# EAGLE design shem_v1.2 (EAGLE 5.08)
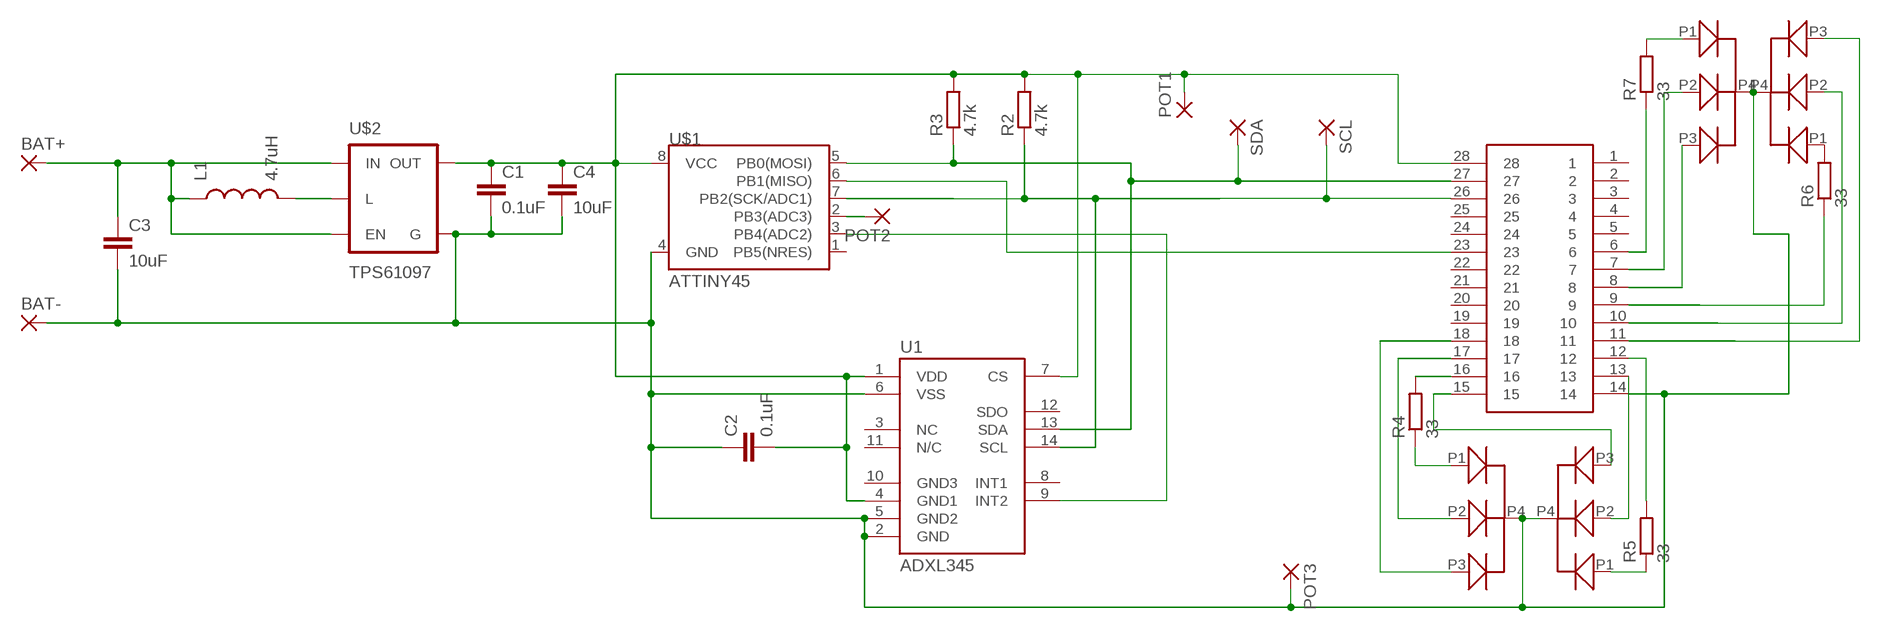
[diagram p0: schematic, sheet 1]

## Parts
BAT+  SMD5  [SMD2,54-5,08]
BAT-  SMD5  [SMD2,54-5,08]
C1  0.1uF  C-EUC1206  [C1206]
C2  0.1uF  C-EUC1206  [C1206]
C3  10uF  C-EUC1206  [C1206]
C4  10uF  C-EUC1206  [C1206]
L1  4.7uH  INDUCTOR1210  [1210]
PCA9635  SSOP28  [SSOP28DB]
POT1  SMD5  [SMD2,54-5,08]
POT2  SMD5  [SMD2,54-5,08]
POT3  SMD5  [SMD2,54-5,08]
R2  4.7k  R-EU_M0805  [M0805]
R3  4.7k  R-EU_M0805  [M0805]
R4  33  R-EU_R0603  [R0603]
R5  33  R-EU_R0603  [R0603]
R6  33  R-EU_R0603  [R0603]
R7  33  R-EU_R0603  [R0603]
SCL  SMD5  [SMD2,54-5,08]
SDA  SMD5  [SMD2,54-5,08]
U1  ADXL345  [LGA14]
U$1  ATTINY45  [SO08-EIAJ]
U$2  TPS61097  [SOT23-5]
U$3  TB5-V120-FLUX-RGB8000  [TB5-V120-FLUX-RGB8000]
U$4  TB5-V120-FLUX-RGB8000  [TB5-V120-FLUX-RGB8000]
U$5  TB5-V120-FLUX-RGB8000  [TB5-V120-FLUX-RGB8000]
U$6  TB5-V120-FLUX-RGB8000  [TB5-V120-FLUX-RGB8000]

## Nets
N$1: BAT-.1(P) C1.2 C2.1 C3.2 C4.2 PCA9635.14 POT3.1(P) U1.2(GND) U1.5(GND2) U1.6(VSS) U$1.4(GND) U$2.2(G) U$3.P4(GND) U$4.P4(GND) U$5.P4(GND) U$6.P4(GND)
N$2: BAT+.1(P) C3.1 L1.1 U$2.1(IN) U$2.3(EN)
N$3: L1.2 U$2.5(L)
N$4: POT2.1(P) U$1.2(PB3(ADC3))
N$6: PCA9635.27 R3.1 SDA.1(P) U1.13(SDA) U$1.5(PB0(MOSI))
N$7: PCA9635.26 R2.1 SCL.1(P) U1.14(SCL) U$1.7(PB2(SCK/ADC1))
N$8: PCA9635.23 U$1.6(PB1(MISO))
N$10: PCA9635.13 U$6.P2(GREEN)
N$11: PCA9635.7 U$3.P2(GREEN)
N$12: PCA9635.8 U$3.P3(BLUE)
N$13: PCA9635.9 R6.1
N$14: PCA9635.10 U$4.P2(GREEN)
N$15: PCA9635.11 U$4.P3(BLUE)
N$16: R5.1 U$6.P1(RED)
N$17: R4.1 U$5.P1(RED)
N$18: PCA9635.18 U$5.P3(BLUE)
N$19: PCA9635.17 U$5.P2(GREEN)
N$20: PCA9635.16 R4.2
N$21: PCA9635.15 U$6.P3(BLUE)
N$22: PCA9635.12 R5.2
N$23: R7.2 U$3.P1(RED)
N$24: U1.9(INT2) U$1.3(PB4(ADC2))
N$25: PCA9635.6 R7.1
N$26: R6.2 U$4.P1(RED)
V+3.3: C1.1 C2.2 C4.1 PCA9635.28 POT1.1(P) R2.2 R3.2 U1.1(VDD) U1.4(GND1) U1.7(CS) U$1.8(VCC) U$2.4(OUT)
Unconnected: PCA9635.1 PCA9635.2 PCA9635.3 PCA9635.4 PCA9635.5 PCA9635.19 PCA9635.20 PCA9635.21 PCA9635.22 PCA9635.24 PCA9635.25 U1.3(NC) U1.8(INT1) U1.10(GND3) U1.11(N/C) U1.12(SDO) U$1.1(PB5(NRES))

## Library data of the parts
BAT+ BAT- POT1-POT3 SCL SDA = wirepad:SMD5: SMD PAD
C1-C4 = resistor:C-EU: CAPACITOR, European symbol
L1 = SparkFun:INDUCTOR: Inductors Basic Inductor/Choke - 0603 and 1206. Footprints are not proven and vary greatly between part numbers.
PCA9635 = SparkFun:SSOP28
R2-R7 = resistor:R-EU_: RESISTOR, European symbol
U1 = SparkFun:ADXL345
U$1 = SparkFun:ATTINY45: Atmel ATTiny45
U$2 = TPS:TPS61097
U$3-U$6 = RGB-LED-protohat:TB5-V120-FLUX-RGB8000: RGB LED

## Board
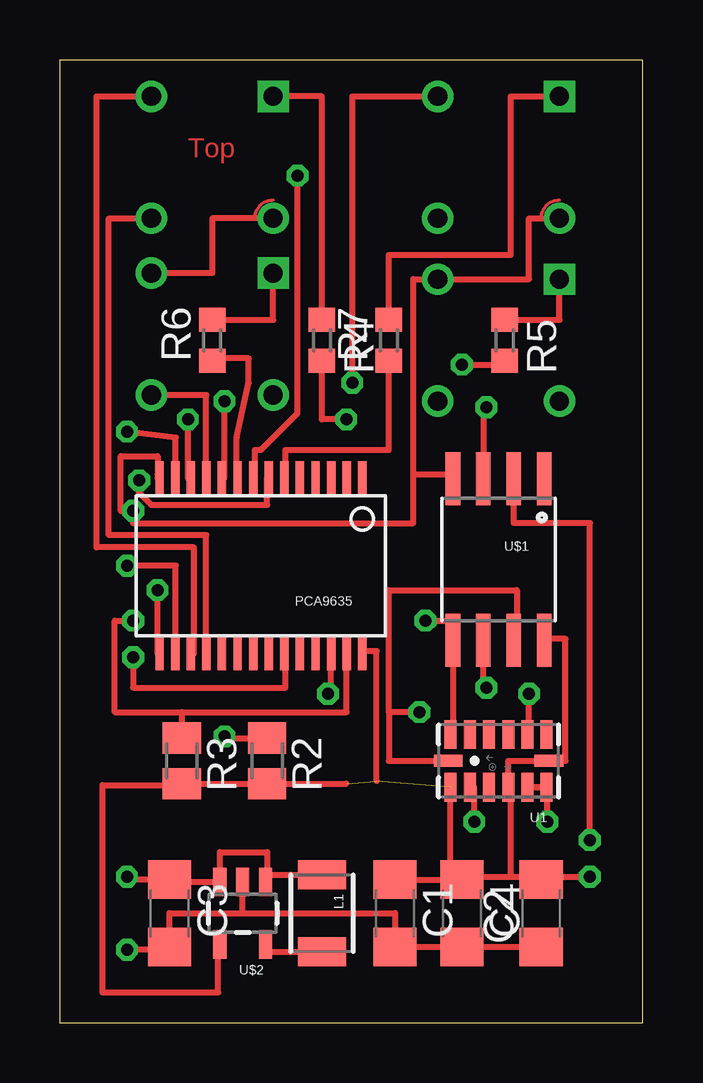
[diagram p1: board, top side]
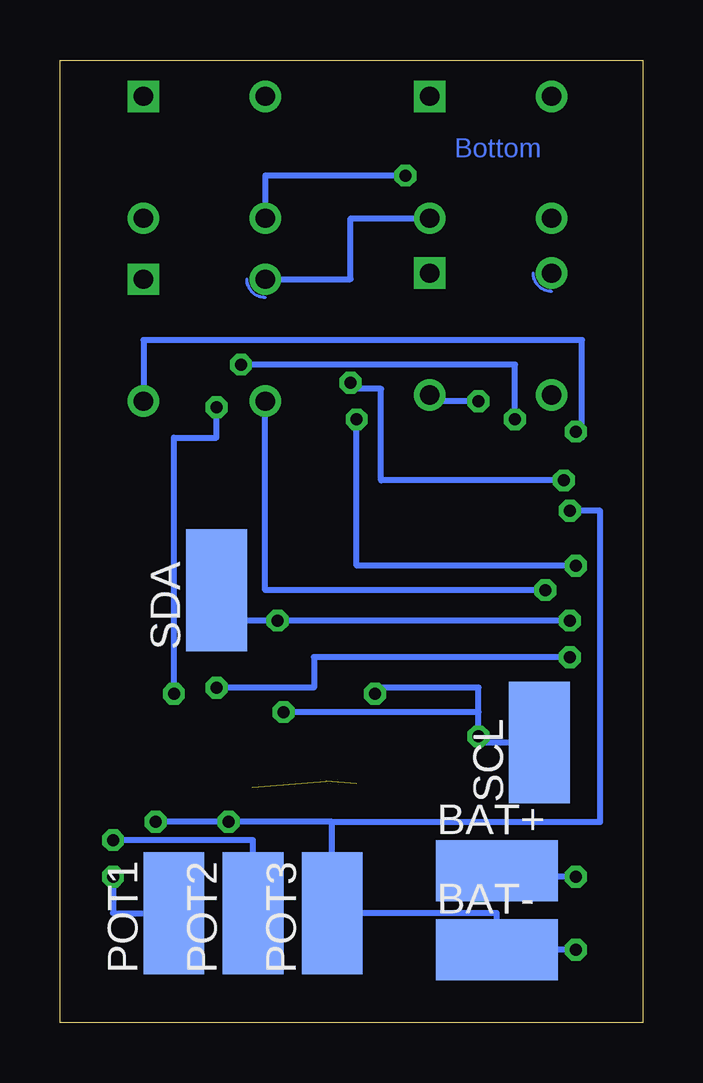
[diagram p2: board, bottom side, seen from below]

Size 24.31 x 40.12 mm. Coordinates in mm from the lower left corner, seen from the top.
Outline: 0,0 24.31,0 24.31,40.12 0,40.12 0,0
Copper layers (1*16): Top 0.035mm / dielectric 1.5mm / Bottom 0.035mm
Design rules "default": minimum track width 10mil, minimum drill 24mil, track to track 8mil, track to pad 8mil, pad to pad 8mil, via to via 8mil, smd to smd 8mil, copper to edge 40mil, drill to drill 8mil, minimum pad ring 10mil, minimum via ring 8mil, stop-mask expansion 4mil, vias tented up to drill 0mil, thermal gap 10mil

### Footprints (pad centres in the part's own frame; a part is rotated, then mirrored left to right if it is on the bottom)
SMD2,54-5,08 = smd 2.54 x 5.08: 1 0,0
C1206 = smd 1.6 x 1.8: 1 -1.4,0; 2 1.4,0
1210 = smd 1.2 x 2: 1 -1.6,0; 2 1.6,0
SSOP28DB = smd 0.348 x 1.397: 1 -4.225,-3.656; 2 -3.575,-3.656; 3 -2.925,-3.656; 4 -2.275,-3.656; 5 -1.625,-3.656; 6 -0.975,-3.656; 7 -0.325,-3.656; 8 0.325,-3.656; 9 0.975,-3.656; 10 1.625,-3.656; 11 2.275,-3.656; 12 2.925,-3.656; 13 3.575,-3.656; 14 4.225,-3.656; 15 4.225,3.656; 16 3.575,3.656; 17 2.925,3.656; 18 2.275,3.656; 19 1.625,3.656; 20 0.975,3.656; 21 0.325,3.656; 22 -0.325,3.656; 23 -0.975,3.656; 24 -1.625,3.656; 25 -2.275,3.656; 26 -2.925,3.656; 27 -3.575,3.656; 28 -4.225,3.656
M0805 = smd 1.3 x 1.6: 1 -0.95,0; 2 0.95,0
R0603 = smd 1 x 1.1: 1 -0.85,0; 2 0.85,0
LGA14 = smd 0.5 x 1.2: 1 2,1.1; 2 1.2,1.1; 3 0.4,1.1; 4 -0.4,1.1; 5 -1.2,1.1; 6 -2,1.1; 8 -2,-1.1; 9 -1.2,-1.1; 10 -0.4,-1.1; 11 0.4,-1.1; 12 1.2,-1.1; 13 2,-1.1 | smd 1.2 x 0.5: 7 -2.1,0; 14 2.1,0
SO08-EIAJ = smd 0.61 x 2.21: 1 -1.905,-3.378; 2 -0.635,-3.378; 3 0.635,-3.378; 4 1.905,-3.378; 5 1.905,3.353; 6 0.635,3.353; 7 -0.635,3.353; 8 -1.905,3.353
SOT23-5 = smd 0.55 x 1.2: 1 -0.95,-1.3; 2 0,-1.3; 3 0.95,-1.3; 4 0.95,1.3; 5 -0.95,1.3
TB5-V120-FLUX-RGB8000 = drill 0.8 pad 1.27 square: P1 0,0 | drill 0.8 pad 1.27 round: P2 0,-5.08; P3 5.08,-5.08; P4 5.08,0

### Placement (x,y rotation side)
BAT+  6.1,6.35 270 bottom
BAT-  6.1,3.05 270 bottom
C1  13.97,4.57 270 top
C2  20.07,4.57 90 top
C3  4.57,4.57 270 top
C4  16.76,4.57 270 top
L1  10.92,4.57 270 top
PCA9635  8.38,19.05 180 top
POT1  19.56,4.57 0 bottom
POT2  16.26,4.57 0 bottom
POT3  12.95,4.57 0 bottom
R2  8.64,10.92 270 top
R3  5.08,10.92 270 top
R4  10.92,28.45 270 top
R5  18.54,28.45 270 top
R6  6.35,28.45 90 top
R7  13.72,28.45 90 top
SCL  4.32,11.68 0 bottom
SDA  17.78,18.03 0 bottom
U1  18.29,10.92 180 top
U$1  18.29,19.3 180 top
U$2  7.62,4.57 180 top
U$3  20.83,38.61 270 top
U$4  8.89,31.24 0 bottom
U$5  8.89,38.61 270 top
U$6  20.83,30.99 0 bottom

### Tracks (layer width: path | path; a pad name or v marks a point on that pad's centre or on a via)
N$1  (via drill 0.5)
  Top 0.254: C2.1 C4.2 C1.2 13.97,4.57 7.62,4.57 | 7.62,4.57 4.57,4.57 C3.2 4.57,3.05 v2.79,3.05 | 7.62,4.57 U$2.2 | U1.6 U1.5 20.32,9.82 v20.32,8.38 | U1.2 17.27,9.82 v17.27,8.38 | U$3.P4 19.56,33.53 19.56,30.99 U$6.P4 14.73,30.99 14.73,22.86 | U$5.P4 6.35,33.53 6.35,31.24 U$4.P4 | 14.73,22.86 16.38,22.86 U$1.4 | 14.73,22.86 14.73,20.83 3.05,20.83 v3.05,21.34 2.54,21.34 2.54,23.62 4.06,23.62 4.06,22.86 4.06,22.71 PCA9635.14
  Bottom 0.254: v2.79,3.05 BAT-.1 6.1,4.57 POT3.1 12.95,8.38 | 12.95,8.38 v17.27,8.38 v20.32,8.38 | 12.95,8.38 1.78,8.38 1.78,21.34 v3.05,21.34 | U$5.P4 12.19,33.53 12.19,30.99 U$6.P4
N$2  (via drill 0.5)
  Top 0.254: L1.1 8.57,6.17 U$2.1 8.64,5.87 8.64,7.11 6.67,7.11 U$2.3 4.57,5.87 C3.1 2.79,5.97 v2.79,6.1
  Bottom 0.254: v2.79,6.1 6.1,6.1 BAT+.1
N$3
  Top 0.254: L1.2 8.57,2.97 U$2.5
N$4  (via drill 0.5)
  Top 0.254: v22.1,7.62 22.1,20.83 18.92,20.83 U$1.2
  Bottom 0.254: POT2.1 16.26,7.62 v22.1,7.62
N$6  (via drill 0.5)
  Top 0.254: U1.13 16.38,12.02 U$1.5 16.26,15.95 16.26,16.26 16.51,16.26 16.51,16.76 v15.24,16.76 | 5.08,12.95 R3.1 | 5.08,12.95 11.96,12.95 PCA9635.27 | v3.05,16.76 2.29,16.76 2.29,12.95 5.08,12.95
  Bottom 0.254: v3.05,16.76 v15.24,16.76 17.78,16.76 SDA.1
N$7  (via drill 0.5)
  Top 0.254: U$1.7 19.05,15.95 19.05,18.03 13.72,18.03 13.72,12.95 | 13.72,12.95 13.72,10.92 U1.14 | R2.1 6.86,11.87 v6.86,11.94 | v11.18,13.72 11.31,13.72 PCA9635.26 | v14.99,12.95 13.72,12.95
  Bottom 0.254: 6.86,12.95 v6.86,11.94 6.86,11.68 SCL.1 | 6.86,12.95 6.86,13.97 11.18,13.97 v11.18,13.72 | 6.86,12.95 v14.99,12.95
N$8  (via drill 0.5)
  Top 0.254: PCA9635.23 9.4,15.39 9.4,13.97 3.05,13.97 v3.05,15.24 | v17.78,13.97 17.65,13.97 U$1.6
  Bottom 0.254: v3.05,15.24 13.72,15.24 13.72,13.97 v17.78,13.97
N$10  (via drill 0.5)
  Top 0.254: PCA9635.13 4.83,22.71 4.83,24.38 v2.79,24.64
  Bottom 0.254: v2.79,24.64 2.54,24.38 2.54,28.45 20.83,28.45 U$6.P2
N$11  (via drill 0.5)
  Top 0.254: PCA9635.7 8.64,22.71 8.64,21.59 3.81,21.59 3.3,22.1 v3.3,22.61 | v12.19,26.67 12.19,38.61 U$3.P2
  Bottom 0.254: v3.3,22.61 10.92,22.61 10.92,26.42 12.19,26.42 v12.19,26.67
N$12  (via drill 0.5)
  Top 0.254: PCA9635.8 8.13,22.71 8.13,23.88 8.38,23.88 9.91,25.4 v9.91,35.31
  Bottom 0.254: v9.91,35.31 15.75,35.31 U$3.P3
N$13
  Top 0.254: PCA9635.9 7.37,22.71 7.37,24.38 7.87,26.67 7.87,27.69 6.35,27.69 R6.1
N$14  (via drill 0.5)
  Top 0.254: PCA9635.10 6.86,22.71 v6.86,25.91
  Bottom 0.254: v6.86,25.91 8.89,25.91 U$4.P2
N$15
  Top 0.254: PCA9635.11 6.1,26.16 U$4.P3
N$16
  Top 0.254: R5.1 20.83,29.3 U$6.P1
N$17
  Top 0.254: R4.1 10.92,38.61 U$5.P1
N$18
  Top 0.254: PCA9635.18 6.1,20.32 2.03,20.32 2.03,33.53 U$5.P3
N$19
  Top 0.254: PCA9635.17 5.59,15.39 5.59,19.81 1.52,19.81 1.52,38.61 U$5.P2
N$20  (via drill 0.5)
  Top 0.254: PCA9635.16 4.83,15.39 4.83,19.05 v2.79,19.05 | R4.2 10.92,25.15 v11.94,25.15
  Bottom 0.254: v2.79,19.05 11.94,19.05 v11.94,25.15
N$21  (via drill 0.5)
  Top 0.254: PCA9635.15 4.06,15.39 v4.06,18.03
  Bottom 0.254: v4.06,18.03 15.75,18.03 U$6.P3
N$22  (via drill 0.5)
  Top 0.254: PCA9635.12 5.33,22.71 v5.33,25.15 | v16.76,27.43 18.54,27.43 R5.2
  Bottom 0.254: v5.33,25.15 5.33,27.43 v16.76,27.43
N$23
  Top 0.254: R7.2 13.72,32 18.8,32 18.8,38.61 U$3.P1
N$24  (via drill 0.5)
  Top 0.254: U1.9 19.56,12.02 v19.56,13.72 | v17.78,25.65 17.65,25.65 U$1.3
  Bottom 0.254: v19.56,13.72 19.56,24.38 17.78,24.38 v17.78,25.65
N$25
  Top 0.254: PCA9635.6 9.4,22.71 9.4,23.88 13.72,23.88 R7.1
N$26
  Top 0.254: R6.2 8.89,29.3 U$4.P1
V+3.3  (via drill 0.5)  (2 unrouted)
  Top 0.254: 11.94,9.97 R2.2 R3.2 5.08,9.91 1.78,9.91 1.78,1.27 6.6,1.27 6.6,3.27 U$2.4 | 16.29,10.07 U1.1 16.29,5.97 | 16.29,5.97 C4.1 17.02,5.97 17.02,6.1 18.8,6.1 | C1.1 16.29,5.97 | 18.8,6.1 20.07,6.1 | 18.8,6.1 18.8,9.82 U1.4 18.69,10.92 U1.7 21.08,10.92 21.08,16 20.19,16 U$1.8 | 20.07,6.1 v22.1,6.1 | 20.07,6.1 C2.2 | 13.21,10.07 13.21,15.49 12.61,15.49 PCA9635.28
  Bottom 0.254: POT1.1 22.1,4.57 v22.1,6.1

### Text on the board
Top: Top
Bottom: Bottom